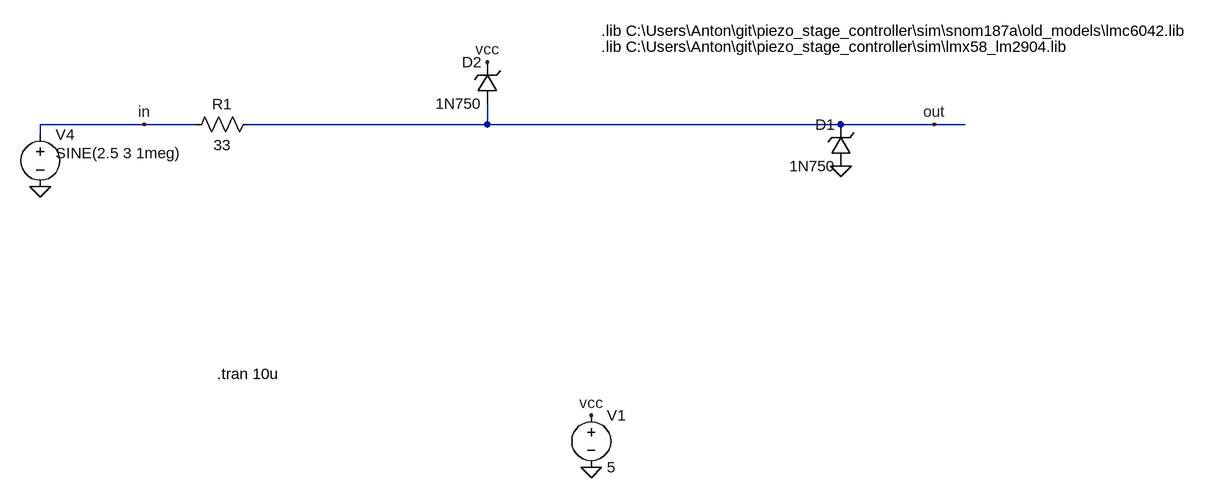
[diagram p0: schematic voltage_limiter.asc]
voltage_limiter.asc, the LTspice schematic file:
Version 4
SHEET 1 1228 712
WIRE -512 -160 -672 -160
WIRE -432 -160 -512 -160
WIRE 16 -160 16 -192
WIRE 16 -160 -352 -160
WIRE 560 -160 16 -160
WIRE 704 -160 560 -160
WIRE 752 -160 704 -160
WIRE -672 -144 -672 -160
FLAG 176 368 0
FLAG 176 288 vcc
FLAG -672 -64 0
FLAG 704 -160 out
FLAG -512 -160 in
FLAG 560 -96 0
FLAG 16 -256 vcc
SYMBOL voltage 176 272 R0
WINDOW 123 0 0 Left 0
WINDOW 39 0 0 Left 0
SYMATTR InstName V1
SYMATTR Value 5
SYMBOL voltage -672 -160 R0
WINDOW 3 24 44 Left 2
WINDOW 123 0 0 Left 0
WINDOW 39 0 0 Left 0
SYMATTR Value SINE(2.5 3 1meg)
SYMATTR InstName V4
SYMBOL res -336 -176 R90
WINDOW 0 0 56 VBottom 2
WINDOW 3 32 56 VTop 2
SYMATTR InstName R1
SYMATTR Value 33
SYMBOL zener 576 -96 R180
WINDOW 0 24 64 Left 2
WINDOW 3 24 0 Left 2
SYMATTR InstName D1
SYMATTR Value 1N750
SYMATTR Description Diode
SYMATTR Type diode
SYMBOL zener 32 -192 R180
WINDOW 0 24 64 Left 2
WINDOW 3 24 0 Left 2
SYMATTR InstName D2
SYMATTR Value 1N750
SYMATTR Description Diode
SYMATTR Type diode
TEXT 192 -304 Left 2 !.lib C:\\Users\\Anton\\git\\piezo_stage_controller\\sim\\snom187a\\old_models\\lmc6042.lib
TEXT -400 224 Left 2 !.tran 10u
TEXT 192 -280 Left 2 !.lib C:\\Users\\Anton\\git\\piezo_stage_controller\\sim\\lmx58_lm2904.lib

The netlist it stands for:
* voltage_limiter.asc
V1 vcc 0 5
V4 in 0 SINE(2.5 3 1meg)
R1 out in 33
D1 0 out 1N750
D2 out vcc 1N750
.model D D
.lib standard.dio
.lib C:\Users\Anton\git\piezo_stage_controller\sim\snom187a\old_models\lmc6042.lib
.tran 10u
.lib C:\Users\Anton\git\piezo_stage_controller\sim\lmx58_lm2904.lib
.backanno
.end